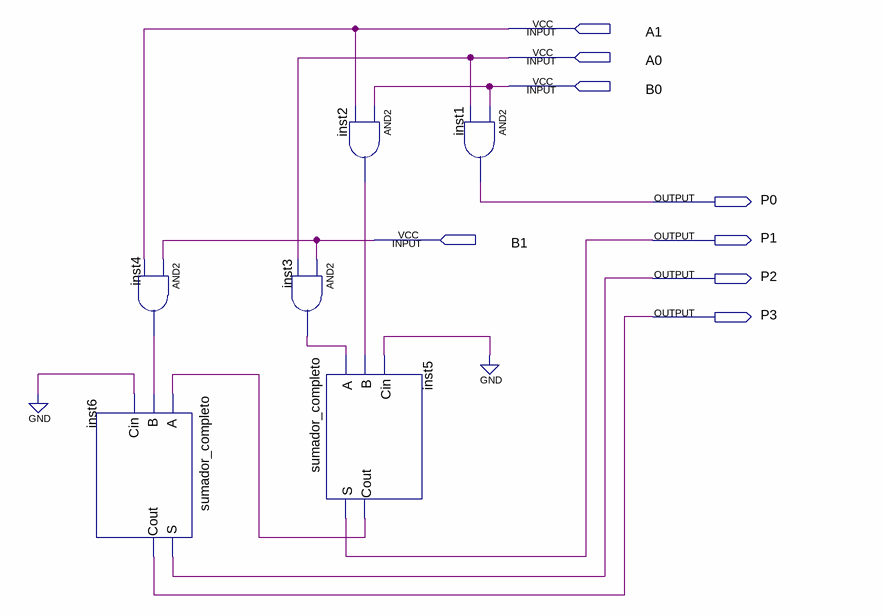
[diagram p0: schematic sheet]
// Quartus schematic mult2x2.bdf as structural Verilog: 6 symbols, 8 pins
module mult2x2 (
  input  A1,
  input  A0,
  input  B0,
  input  B1,
  output P0,
  output P1,
  output P2,
  output P3
);

  wire inst2_out, inst3_out, inst4_out, inst5_cout;

  sumador_completo inst6 (.A(inst5_cout), .B(inst4_out), .Cin(1'b0), .S(P2), .Cout(P3));
  and inst4 (inst4_out, B1, A1);
  and inst3 (inst3_out, B1, A0);
  sumador_completo inst5 (.A(inst3_out), .B(inst2_out), .Cin(1'b0), .S(P1), .Cout(inst5_cout));
  and inst2 (inst2_out, B0, A1);
  and inst1 (P0, B0, A0);
endmodule
